# EAGLE schematic 140182-1-v2.1-j2b-synth (EAGLE 6.6.0)
AUTHOR: CPV; NRS: 140182-1; REV: 2.1

## Sheet 1 of 6
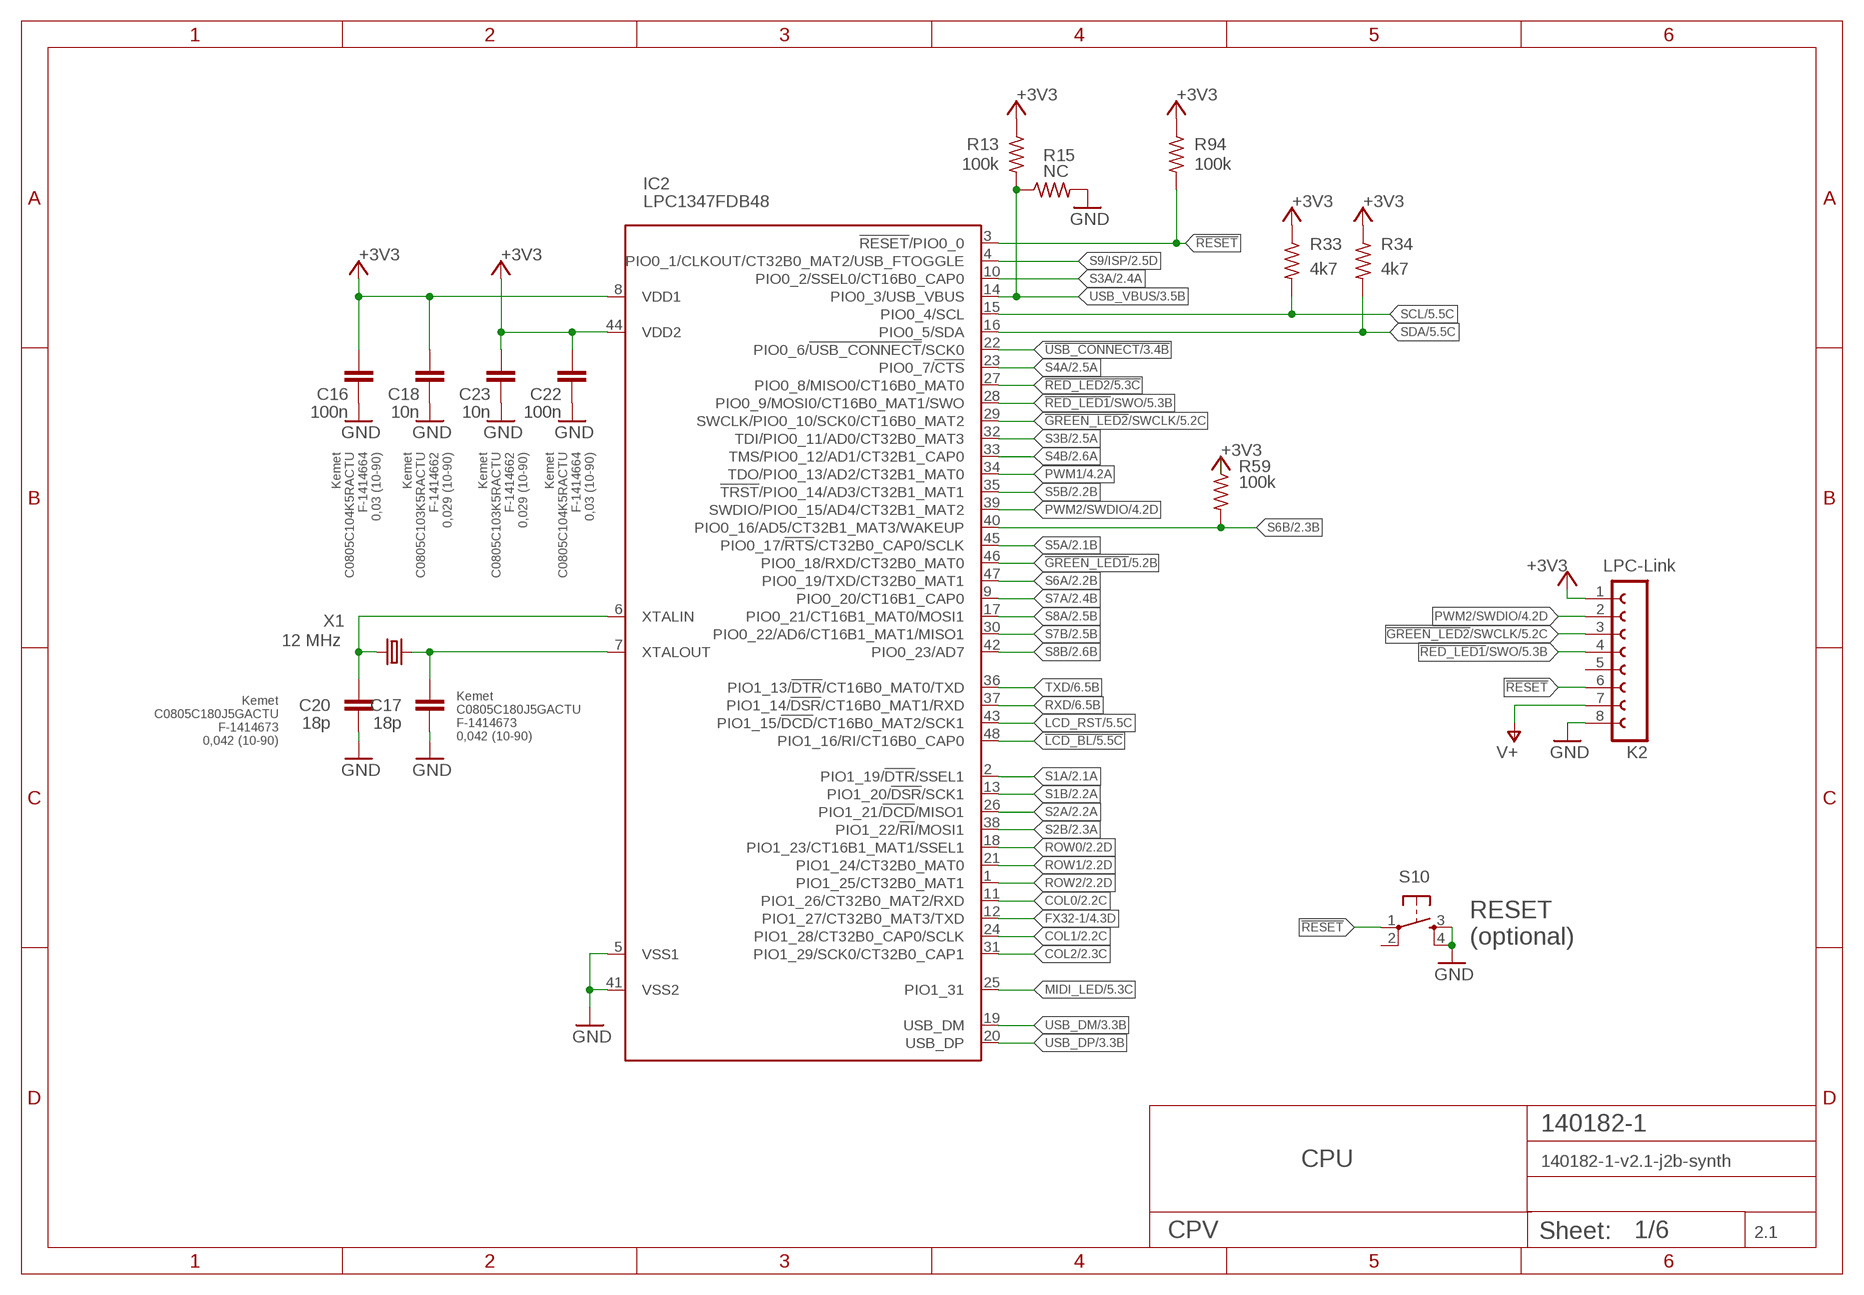
[diagram p0: schematic, sheet 1]

### Parts
C16  100n  C-EUC0805K  [C0805K]
C17  18p  C-EUC0805K  [C0805K]
C18  10n  C-EUC0805K  [C0805K]
C20  18p  C-EUC0805K  [C0805K]
C22  100n  C-EUC0805K  [C0805K]
C23  10n  C-EUC0805K  [C0805K]
IC2  LPC1347FDB48  [LQFP48]
K2  LPC-Link  FE08-1  [FE08]
R13  100k  R-US_R0805  [R0805]
R15  NC  R-US_R0805  [R0805]
R33  4k7  R-US_R0805  [R0805]
R34  4k7  R-US_R0805  [R0805]
R59  100k  R-US_R0805  [R0805]
R94  100k  R-US_R0805  [R0805]
S10  S-TACTILE-6X6-PTH  [EPP-S-TACT-6X6]
X1  12 MHz  CRYSTALSM49  [SM49]

### Nets
!GREEN_LED1!: IC2.46(PIO0_18/RXD/CT32B0_MAT0) ; also sheet 5
!GREEN_LED2!/SWCLK: IC2.29(SWCLK/PIO0_10/SCK0/CT16B0_MAT2) K2.3 ; also sheet 5
!LCD_BL: IC2.48(PIO1_16/RI/CT16B0_CAP0) ; also sheet 5
!RED_LED1!/SWO: IC2.28(PIO0_9/MOSI0/CT16B0_MAT1/SWO) K2.4 ; also sheet 5
!RED_LED2: IC2.27(PIO0_8/MISO0/CT16B0_MAT0) ; also sheet 5
!RESET: IC2.3(!RESET!/PIO0_0) K2.6 R94.2 S10.1
!USB_CONNECT: IC2.22(PIO0_6/!USB_CONNECT!/SCK0) ; also sheet 3
+3V3: C16.2 C18.2 C22.2 C23.2 IC2.8(VDD1) IC2.44(VDD2) K2.1 R13.1 R33.1 R34.1 R59.1 R94.1 ; also sheet 2,3,4,5
+5V: K2.7 ; supply symbol labelled V+ ; also sheet 3,4,5,6
COL0: IC2.11(PIO1_26/CT32B0_MAT2/RXD) ; also sheet 2
COL1: IC2.24(PIO1_28/CT32B0_CAP0/SCLK) ; also sheet 2
COL2: IC2.31(PIO1_29/SCK0/CT32B0_CAP1) ; also sheet 2
FX32-1: IC2.12(PIO1_27/CT32B0_MAT3/TXD) ; also sheet 4
GND: C16.1 C17.1 C18.1 C20.1 C22.1 C23.1 IC2.5(VSS1) IC2.41(VSS2) K2.8 R15.2 S10.3 S10.4 ; also sheet 2,3,4,5,6
LCD_RST: IC2.43(PIO1_15/!DCD!/CT16B0_MAT2/SCK1) ; also sheet 5
MIDI_LED: IC2.25(PIO1_31) ; also sheet 5
N$4: C20.2 IC2.6(XTALIN) X1.1
N$5: C17.2 IC2.7(XTALOUT) X1.2
PWM1: IC2.34(TDO/PIO0_13/AD2/CT32B1_MAT0) ; also sheet 4
PWM2/SWDIO: IC2.39(SWDIO/PIO0_15/AD4/CT32B1_MAT2) K2.2 ; also sheet 4
ROW0: IC2.18(PIO1_23/CT16B1_MAT1/SSEL1) ; also sheet 2
ROW1: IC2.21(PIO1_24/CT32B0_MAT0) ; also sheet 2
ROW2: IC2.1(PIO1_25/CT32B0_MAT1) ; also sheet 2
RXD: IC2.37(PIO1_14/!DSR!/CT16B0_MAT1/RXD) ; also sheet 6
S1A: IC2.2(PIO1_19/!DTR!/SSEL1) ; also sheet 2
S1B: IC2.13(PIO1_20/!DSR!/SCK1) ; also sheet 2
S2A: IC2.26(PIO1_21/!DCD!/MISO1) ; also sheet 2
S2B: IC2.38(PIO1_22/!RI!/MOSI1) ; also sheet 2
S3A: IC2.10(PIO0_2/SSEL0/CT16B0_CAP0) ; also sheet 2
S3B: IC2.32(TDI/PIO0_11/AD0/CT32B0_MAT3) ; also sheet 2
S4A: IC2.23(PIO0_7/!CTS) ; also sheet 2
S4B: IC2.33(TMS/PIO0_12/AD1/CT32B1_CAP0) ; also sheet 2
S5A: IC2.45(PIO0_17/!RTS!/CT32B0_CAP0/SCLK) ; also sheet 2
S5B: IC2.35(!TRST!/PIO0_14/AD3/CT32B1_MAT1) ; also sheet 2
S6A: IC2.47(PIO0_19/TXD/CT32B0_MAT1) ; also sheet 2
S6B: IC2.40(PIO0_16/AD5/CT32B1_MAT3/WAKEUP) R59.2 ; also sheet 2
S7A: IC2.9(PIO0_20/CT16B1_CAP0) ; also sheet 2
S7B: IC2.30(PIO0_22/AD6/CT16B1_MAT1/MISO1) ; also sheet 2
S8A: IC2.17(PIO0_21/CT16B1_MAT0/MOSI1) ; also sheet 2
S8B: IC2.42(PIO0_23/AD7) ; also sheet 2
S9/ISP: IC2.4(PIO0_1/CLKOUT/CT32B0_MAT2/USB_FTOGGLE) ; also sheet 2
SCL: IC2.15(PIO0_4/SCL) R33.2 ; also sheet 5
SDA: IC2.16(PIO0_5/SDA) R34.2 ; also sheet 5
TXD: IC2.36(PIO1_13/!DTR!/CT16B0_MAT0/TXD) ; also sheet 6
USB_DM: IC2.19(USB_DM) ; also sheet 3
USB_DP: IC2.20(USB_DP) ; also sheet 3
USB_VBUS: IC2.14(PIO0_3/USB_VBUS) R13.2 R15.1 ; also sheet 3
Unconnected: K2.5 S10.2

### Notes on the sheet
- RESET
  (optional)
- CPU

## Sheet 2 of 6
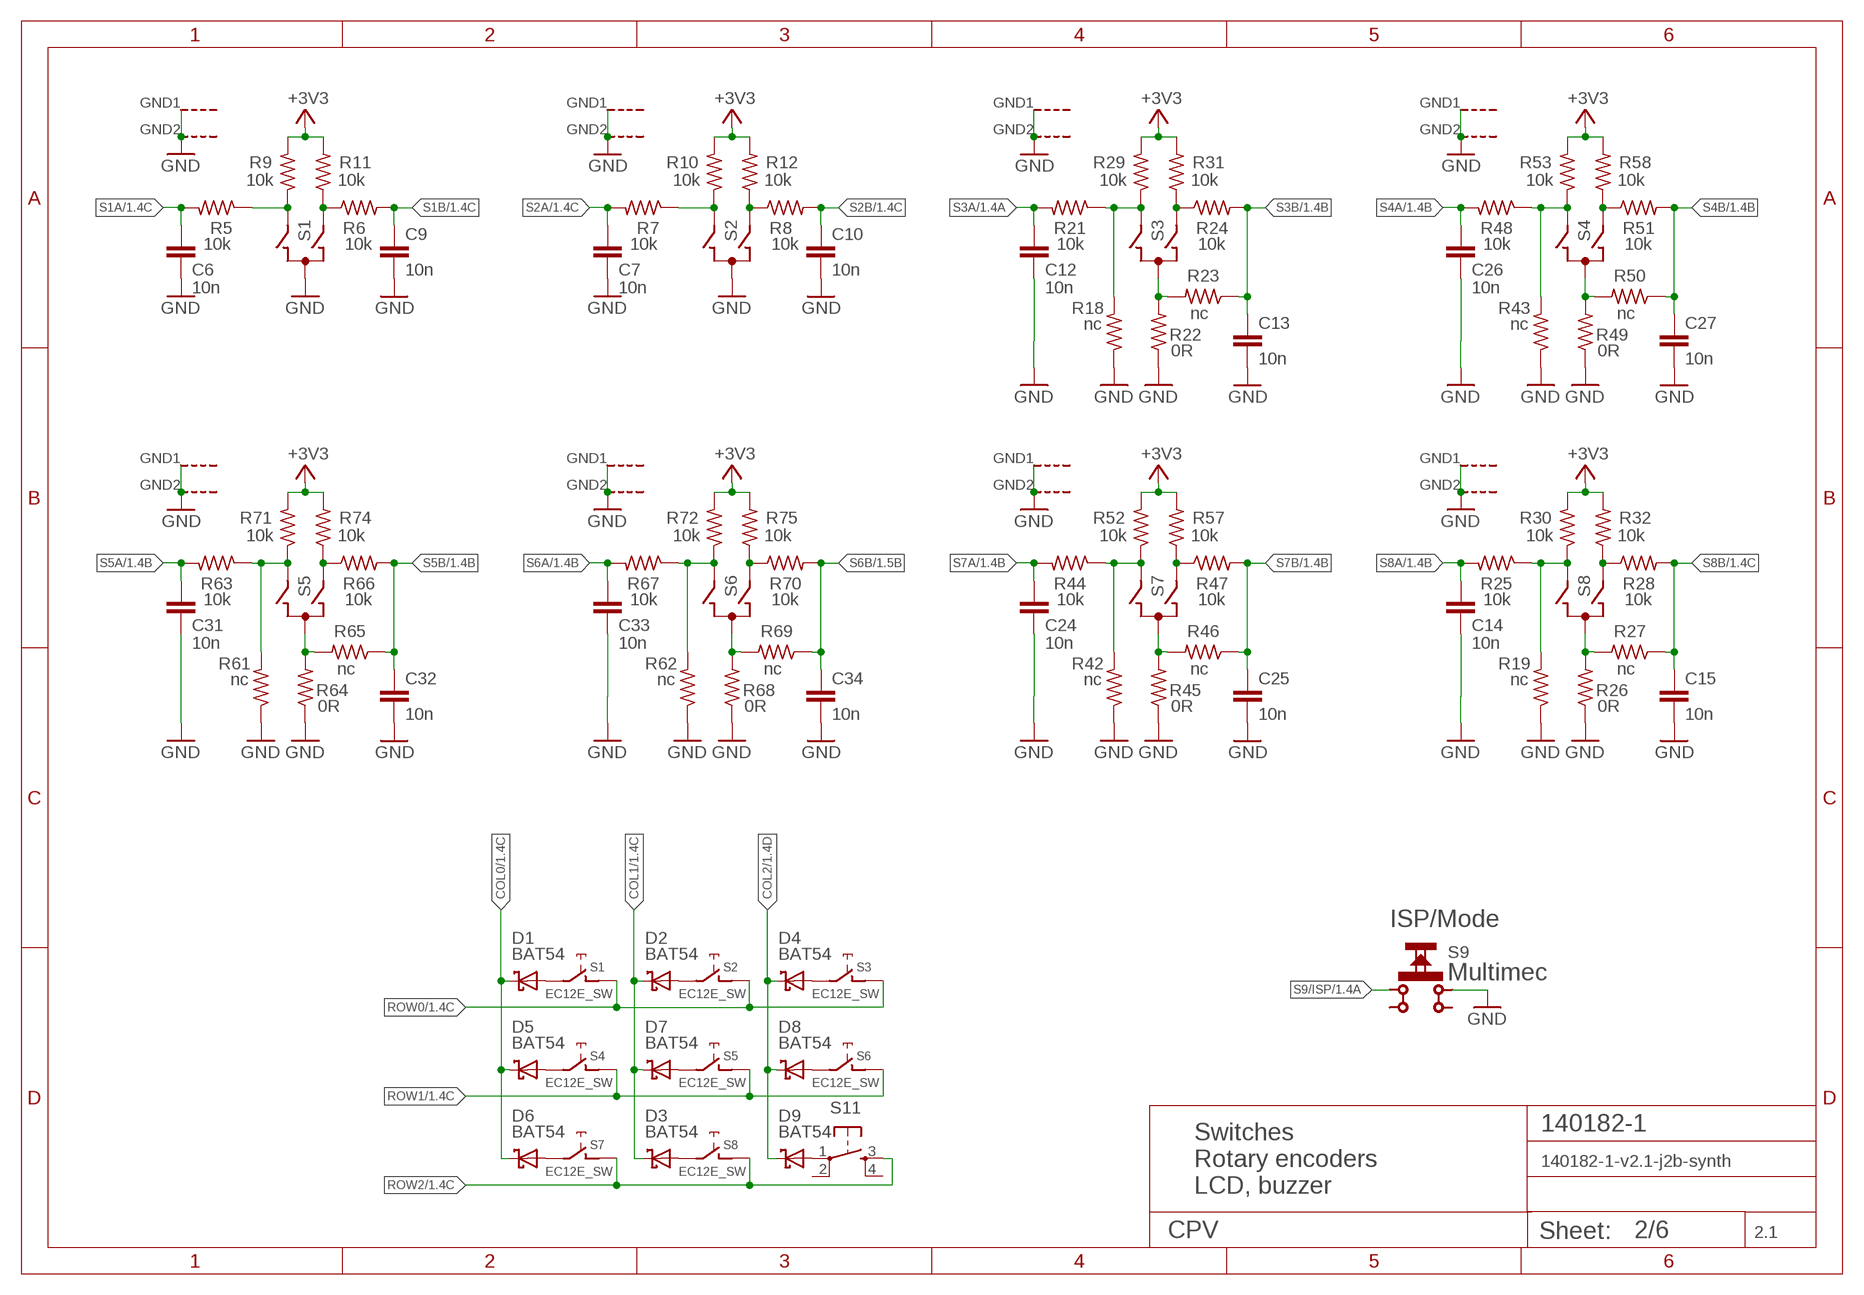
[diagram p1: schematic, sheet 2]

### Parts
C6  10n  C-EUC0805K  [C0805K]
C7  10n  C-EUC0805K  [C0805K]
C9  10n  C-EUC0805K  [C0805K]
C10  10n  C-EUC0805K  [C0805K]
C12  10n  C-EUC0805K  [C0805K]
C13  10n  C-EUC0805K  [C0805K]
C14  10n  C-EUC0805K  [C0805K]
C15  10n  C-EUC0805K  [C0805K]
C24  10n  C-EUC0805K  [C0805K]
C25  10n  C-EUC0805K  [C0805K]
C26  10n  C-EUC0805K  [C0805K]
C27  10n  C-EUC0805K  [C0805K]
C31  10n  C-EUC0805K  [C0805K]
C32  10n  C-EUC0805K  [C0805K]
C33  10n  C-EUC0805K  [C0805K]
C34  10n  C-EUC0805K  [C0805K]
D1  BAT54  [SOT23]
D2  BAT54  [SOT23]
D3  BAT54  [SOT23]
D4  BAT54  [SOT23]
D5  BAT54  [SOT23]
D6  BAT54  [SOT23]
D7  BAT54  [SOT23]
D8  BAT54  [SOT23]
D9  BAT54  [SOT23]
R5  10k  R-US_R0805  [R0805]
R6  10k  R-US_R0805  [R0805]
R7  10k  R-US_R0805  [R0805]
R8  10k  R-US_R0805  [R0805]
R9  10k  R-US_R0805  [R0805]
R10  10k  R-US_R0805  [R0805]
R11  10k  R-US_R0805  [R0805]
R12  10k  R-US_R0805  [R0805]
R18  nc  R-US_R0805  [R0805]
R19  nc  R-US_R0805  [R0805]
R21  10k  R-US_R0805  [R0805]
R22  0R  R-US_R0805  [R0805]
R23  nc  R-US_R0805  [R0805]
R24  10k  R-US_R0805  [R0805]
R25  10k  R-US_R0805  [R0805]
R26  0R  R-US_R0805  [R0805]
R27  nc  R-US_R0805  [R0805]
R28  10k  R-US_R0805  [R0805]
R29  10k  R-US_R0805  [R0805]
R30  10k  R-US_R0805  [R0805]
R31  10k  R-US_R0805  [R0805]
R32  10k  R-US_R0805  [R0805]
R42  nc  R-US_R0805  [R0805]
R43  nc  R-US_R0805  [R0805]
R44  10k  R-US_R0805  [R0805]
R45  0R  R-US_R0805  [R0805]
R46  nc  R-US_R0805  [R0805]
R47  10k  R-US_R0805  [R0805]
R48  10k  R-US_R0805  [R0805]
R49  0R  R-US_R0805  [R0805]
R50  nc  R-US_R0805  [R0805]
R51  10k  R-US_R0805  [R0805]
R52  10k  R-US_R0805  [R0805]
R53  10k  R-US_R0805  [R0805]
R57  10k  R-US_R0805  [R0805]
R58  10k  R-US_R0805  [R0805]
R61  nc  R-US_R0805  [R0805]
R62  nc  R-US_R0805  [R0805]
R63  10k  R-US_R0805  [R0805]
R64  0R  R-US_R0805  [R0805]
R65  nc  R-US_R0805  [R0805]
R66  10k  R-US_R0805  [R0805]
R67  10k  R-US_R0805  [R0805]
R68  0R  R-US_R0805  [R0805]
R69  nc  R-US_R0805  [R0805]
R70  10k  R-US_R0805  [R0805]
R71  10k  R-US_R0805  [R0805]
R72  10k  R-US_R0805  [R0805]
R74  10k  R-US_R0805  [R0805]
R75  10k  R-US_R0805  [R0805]
S1  EC12E_SW  [ALPS_EC12E_SW]
S2  EC12E_SW  [ALPS_EC12E_SW]
S3  EC12E_SW  [ALPS_EC12E_SW]
S4  EC12E_SW  [ALPS_EC12E_SW]
S5  EC12E_SW  [ALPS_EC12E_SW]
S6  EC12E_SW  [ALPS_EC12E_SW]
S7  EC12E_SW  [ALPS_EC12E_SW]
S8  EC12E_SW  [ALPS_EC12E_SW]
S9  Multimec  PUSH_BUTTON_MULTIMEC_4_PIN  [PUSHBUTTON_MULTIMEC]
S11  S-TACTILE-6X6-PTH  [EPP-S-TACT-6X6]

### Nets
+3V3: R9.2 R10.2 R11.2 R12.2 R29.2 R30.2 R31.2 R32.2 R52.2 R53.2 R57.2 R58.2 R71.2 R72.2 R74.2 R75.2 ; also sheet 1,3,4,5
COL0: D1.3(C) D5.3(C) D6.3(C) ; also sheet 1
COL1: D2.3(C) D3.3(C) D7.3(C) ; also sheet 1
COL2: D4.3(C) D8.3(C) D9.3(C) ; also sheet 1
GND: C6.1 C7.1 C9.1 C10.1 C12.1 C13.1 C14.1 C15.1 C24.1 C25.1 C26.1 C27.1 C31.1 C32.1 C33.1 C34.1 R18.1 R19.1 R22.1 R26.1 R42.1 R43.1 R45.1 R49.1 R61.1 R62.1 R64.1 R68.1 S1.C S1.GND1(G) S1.GND2(G) S2.C S2.GND1(G) S2.GND2(G) S3.GND1(G) S3.GND2(G) S4.GND1(G) S4.GND2(G) S5.GND1(G) S5.GND2(G) S6.GND1(G) S6.GND2(G) S7.GND1(G) S7.GND2(G) S8.GND1(G) S8.GND2(G) S9.3 ; also sheet 1,3,4,5,6
N$1: D9.1(A) S11.1
N$35: D1.1(A) S1.E
N$36: D2.1(A) S2.E
N$46: R66.1 R74.1 S5.A
N$47: R61.2 R63.1 R71.1 S5.B
N$70: D4.1(A) S3.E
N$71: D5.1(A) S4.E
N$74: D7.1(A) S5.E
N$75: D8.1(A) S6.E
N$76: D6.1(A) S7.E
N$77: D3.1(A) S8.E
N$78: R64.2 R65.2 S5.C
N$79: R6.1 R11.1 S1.A
N$80: R5.1 R9.1 S1.B
N$82: R70.1 R75.1 S6.A
N$83: R62.2 R67.1 R72.1 S6.B
N$84: R68.2 R69.2 S6.C
N$85: R8.1 R12.1 S2.A
N$86: R7.1 R10.1 S2.B
N$88: R47.1 R57.1 S7.A
N$89: R42.2 R44.1 R52.1 S7.B
N$90: R45.2 R46.2 S7.C
N$91: R24.1 R31.1 S3.A
N$92: R18.2 R21.1 R29.1 S3.B
N$93: R22.2 R23.2 S3.C
N$108: R28.1 R32.1 S8.A
N$109: R19.2 R25.1 R30.1 S8.B
N$110: R26.2 R27.2 S8.C
N$111: R51.1 R58.1 S4.A
N$112: R43.2 R48.1 R53.1 S4.B
N$113: R49.2 R50.2 S4.C
ROW0: S1.D S2.D S3.D ; also sheet 1
ROW1: S4.D S5.D S6.D ; also sheet 1
ROW2: S7.D S8.D S11.3 ; also sheet 1
S1A: C6.2 R5.2 ; also sheet 1
S1B: C9.2 R6.2 ; also sheet 1
S2A: C7.2 R7.2 ; also sheet 1
S2B: C10.2 R8.2 ; also sheet 1
S3A: C12.2 R21.2 ; also sheet 1
S3B: C13.2 R23.1 R24.2 ; also sheet 1
S4A: C26.2 R48.2 ; also sheet 1
S4B: C27.2 R50.1 R51.2 ; also sheet 1
S5A: C31.2 R63.2 ; also sheet 1
S5B: C32.2 R65.1 R66.2 ; also sheet 1
S6A: C33.2 R67.2 ; also sheet 1
S6B: C34.2 R69.1 R70.2 ; also sheet 1
S7A: C24.2 R44.2 ; also sheet 1
S7B: C25.2 R46.1 R47.2 ; also sheet 1
S8A: C14.2 R25.2 ; also sheet 1
S8B: C15.2 R27.1 R28.2 ; also sheet 1
S9/ISP: S9.1 ; also sheet 1
Unconnected: S9.2 S9.4 S11.2 S11.4

### Notes on the sheet
- ISP/Mode
- Switches
- Rotary encoders
- LCD, buzzer

## Sheet 3 of 6
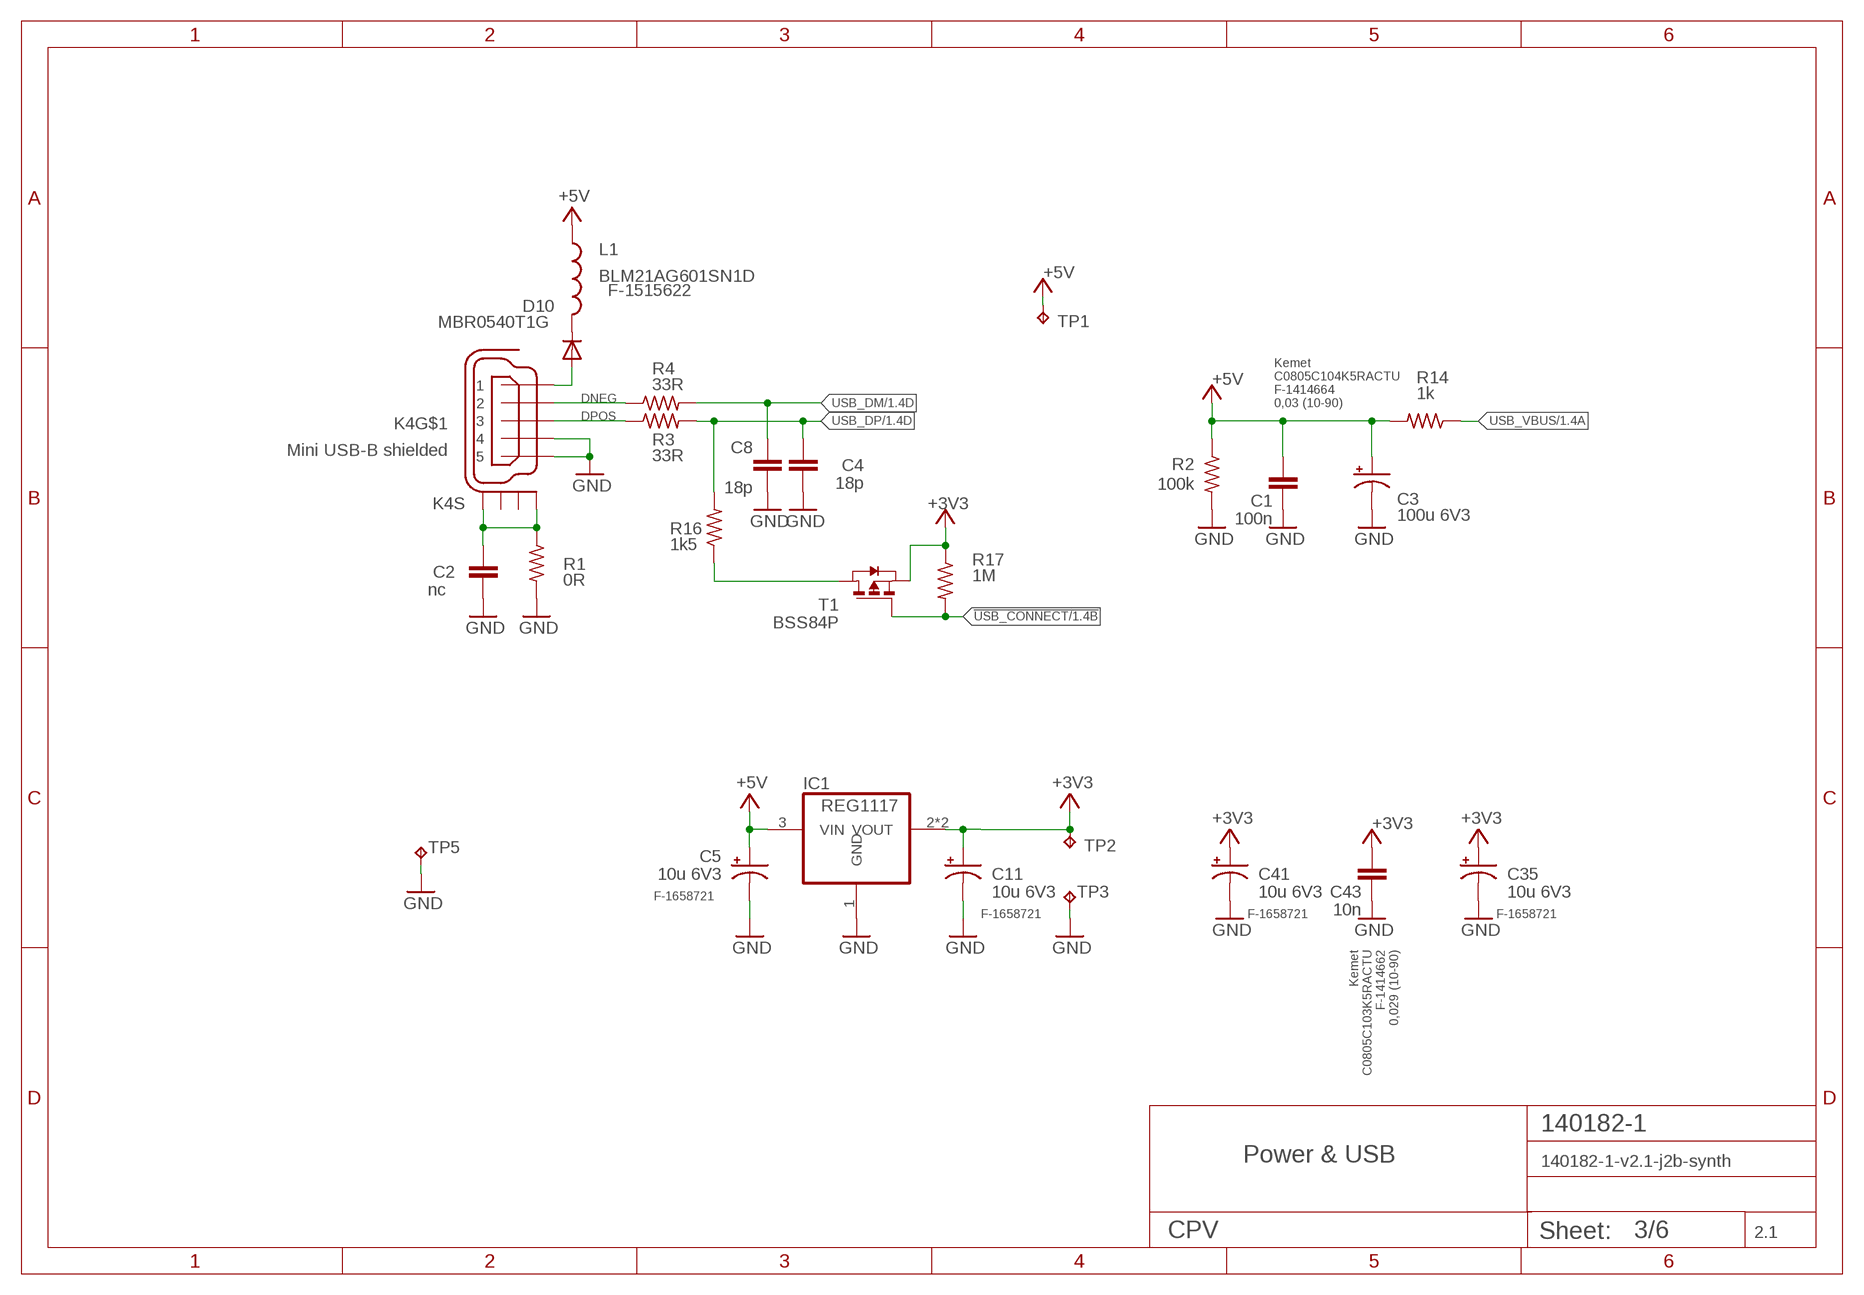
[diagram p2: schematic, sheet 3]

### Parts
C1  100n  C-EUC0805K  [C0805K]
C2  nc  C-EUC0805K  [C0805K]
C3  100u 6V3  CPOL-USB/3528-21R  [B/3528-21R]
C4  18p  C-EUC0805K  [C0805K]
C5  10u 6V3  CPOL-USSMCZ  [SMC_Z]
C8  18p  C-EUC0805K  [C0805K]
C11  10u 6V3  CPOL-USSMCZ  [SMC_Z]
C35  10u 6V3  CPOL-USSMCZ  [SMC_Z]
C41  10u 6V3  CPOL-USSMCZ  [SMC_Z]
C43  10n  C-EUC0805K  [C0805K]
D10  MBR0540T1G  MBR0520LT  [SOD123]
IC1  REG1117  [SOT223]
K4  Mini USB-B shielded  MINI-USB-SCHIELD-32005-301  [USB-MINI-B]
L1  BLM21AG601SN1D  INDUCTOR0805  [0805]
R1  0R  R-US_R0805  [R0805]
R2  100k  R-US_R0805  [R0805]
R3  33R  R-US_R0805  [R0805]
R4  33R  R-US_R0805  [R0805]
R14  1k  R-US_R0805  [R0805]
R16  1k5  R-US_R0805  [R0805]
R17  1M  R-US_R0805  [R0805]
T1  BSS84P  PMOSSOT23  [SOT-23]
TP1  TPPAD1-13  [P1-13]
TP2  TPPAD1-13  [P1-13]
TP3  TPPAD1-13  [P1-13]
TP5  TPPAD1-13  [P1-13]

### Nets
!USB_CONNECT: R17.2 T1.3(G) ; also sheet 1
+3V3: C11.+ C35.+ C41.+ C43.2 IC1.2(VOUT) IC1.4(VOUT) R17.1 T1.2(S) TP2.TP ; also sheet 1,2,4,5
+5V: C1.2 C3.+ C5.+ IC1.3(VIN) L1.2 R2.1 R14.2 TP1.TP ; also sheet 1,4,5,6
DNEG: K4.2 R4.1
DPOS: K4.3 R3.1
GND: C1.1 C2.2 C3.- C4.2 C5.- C8.2 C11.- C35.- C41.- C43.1 IC1.1(GND) K4.4 K4.5 R1.2 R2.2 TP3.TP TP5.TP ; also sheet 1,2,4,5,6
N$6: D10.C L1.1
N$9: C2.1 K4.M1(S:S1) K4.M4(S:S4) R1.1
N$19: D10.A K4.1
N$28: R16.1 T1.1(D)
USB_DM: C8.1 R4.2 ; also sheet 1
USB_DP: C4.1 R3.2 R16.2 ; also sheet 1
USB_VBUS: R14.1 ; also sheet 1
Unconnected: K4.M2(S:S2) K4.M3(S:S3)

### Notes on the sheet
- F-1515622
- Power & USB

## Sheet 4 of 6
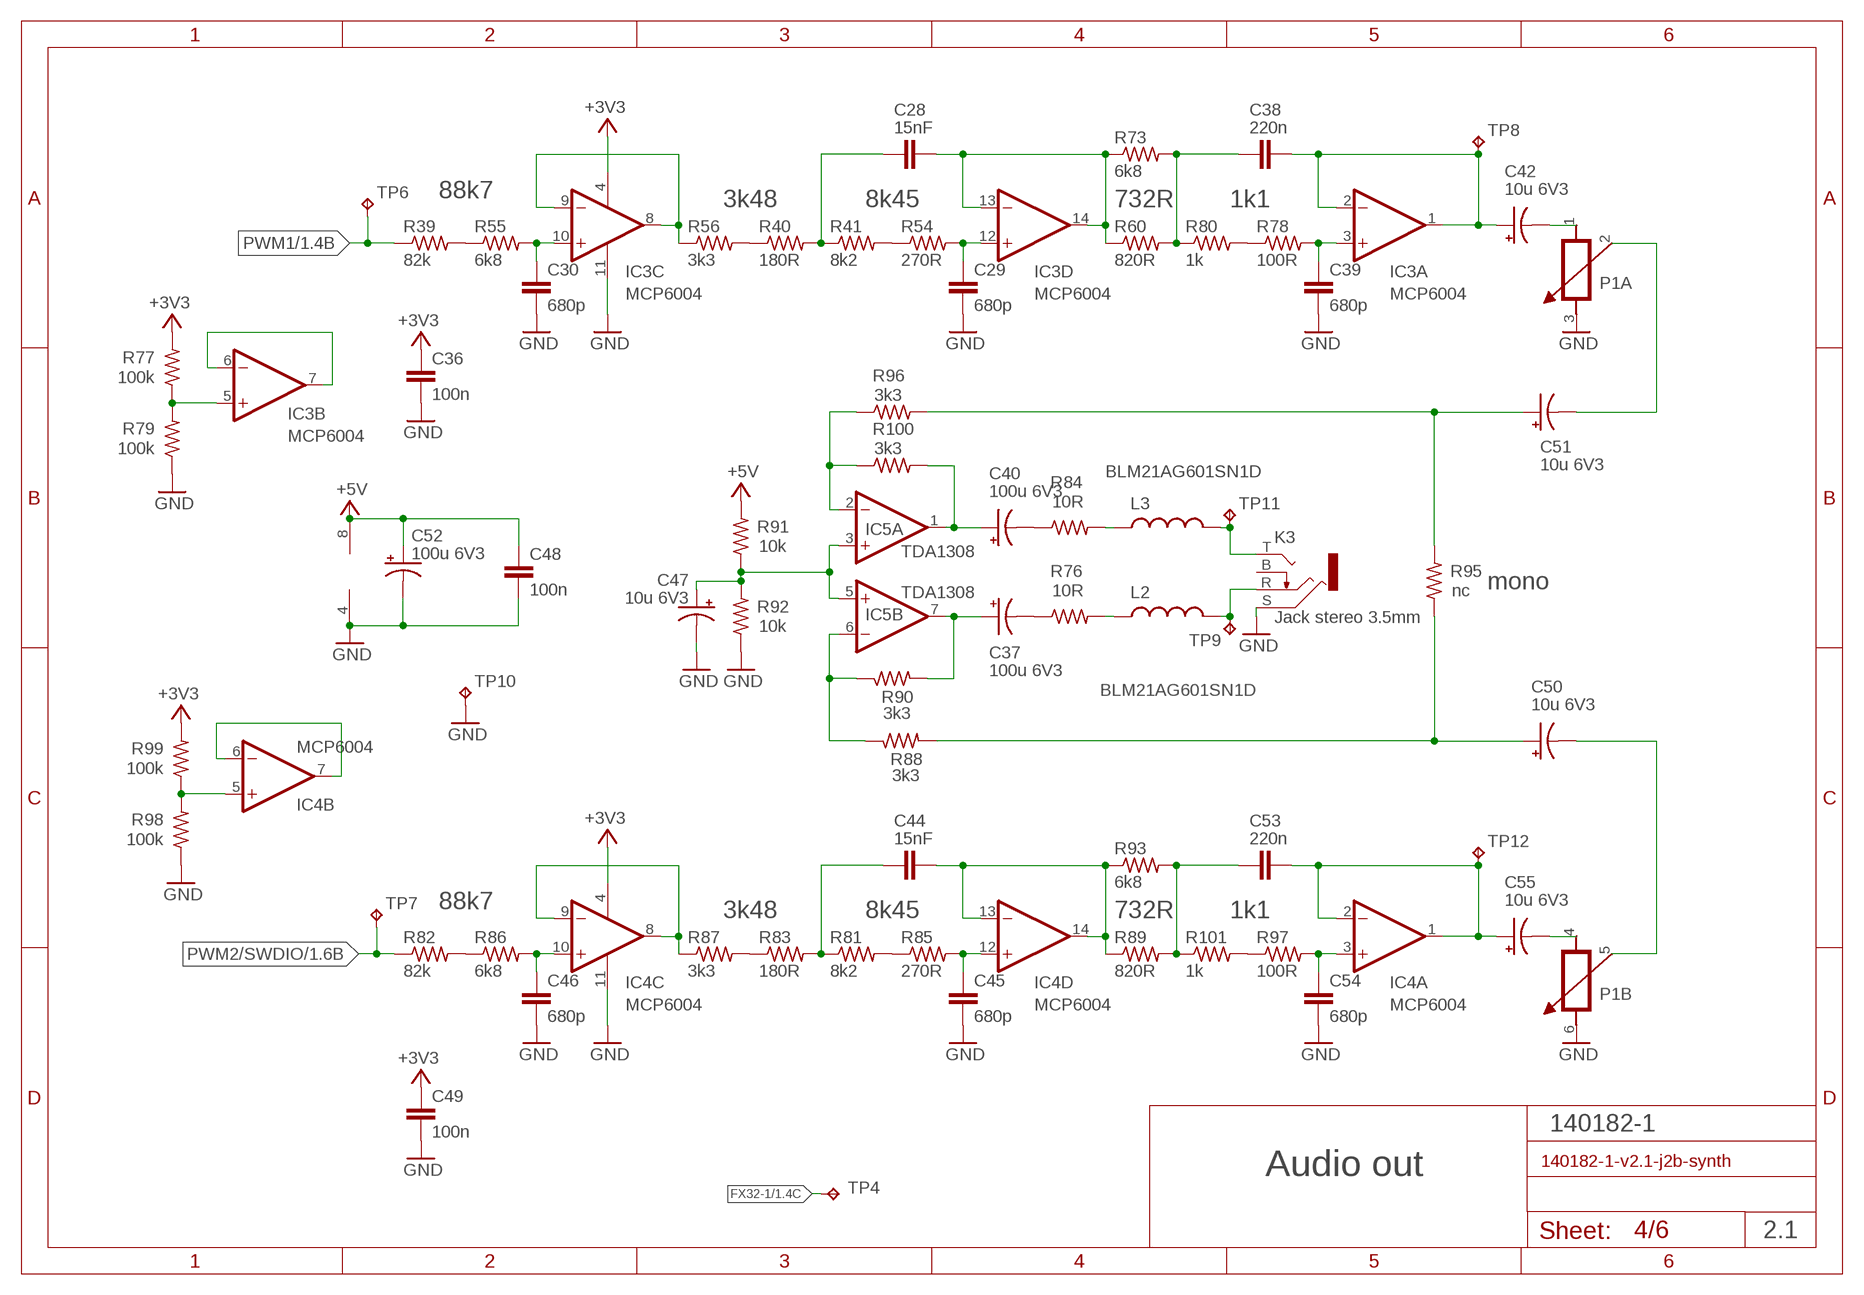
[diagram p3: schematic, sheet 4]

### Parts
C28  15nF  C-EUC0805K  [C0805K]
C29  680p  C-EUC0805K  [C0805K]
C30  680p  C-EUC0805K  [C0805K]
C36  100n  C-EUC0805K  [C0805K]
C37  100u 6V3  CPOL-USB/3528-21R  [B/3528-21R]
C38  220n  C-EUC0805K  [C0805K]
C39  680p  C-EUC0805K  [C0805K]
C40  100u 6V3  CPOL-USB/3528-21R  [B/3528-21R]
C42  10u 6V3  CPOL-USSMCZ  [SMC_Z]
C44  15nF  C-EUC0805K  [C0805K]
C45  680p  C-EUC0805K  [C0805K]
C46  680p  C-EUC0805K  [C0805K]
C47  10u 6V3  CPOL-USSMCZ  [SMC_Z]
C48  100n  C-EUC0805K  [C0805K]
C49  100n  C-EUC0805K  [C0805K]
C50  10u 6V3  CPOL-USSMCZ  [SMC_Z]
C51  10u 6V3  CPOL-USSMCZ  [SMC_Z]
C52  100u 6V3  CPOL-USB/3528-21R  [B/3528-21R]
C53  220n  C-EUC0805K  [C0805K]
C54  680p  C-EUC0805K  [C0805K]
C55  10u 6V3  CPOL-USSMCZ  [SMC_Z]
IC3  MCP6004  TL074D  [SO14]
IC4  MCP6004  TL074D  [SO14]
IC5  TDA1308  LM1458D  [SO08]
K3  Jack stereo 3.5mm  K-JACK-STEREO-3.5MM  [EPP-JACK-35]
L2  BLM21AG601SN1D  INDUCTOR0805  [0805]
L3  BLM21AG601SN1D  INDUCTOR0805  [0805]
P1  POT-BOURNS-PDT90  [POT-BOURNS-PTD90-2-WAY]
R39  82k  R-US_R0805  [R0805]
R40  180R  R-US_R0805  [R0805]
R41  8k2  R-US_R0805  [R0805]
R54  270R  R-US_R0805  [R0805]
R55  6k8  R-US_R0805  [R0805]
R56  3k3  R-US_R0805  [R0805]
R60  820R  R-US_R0805  [R0805]
R73  6k8  R-US_R0805  [R0805]
R76  10R  R-US_R0805  [R0805]
R77  100k  R-US_R0805  [R0805]
R78  100R  R-US_R0805  [R0805]
R79  100k  R-US_R0805  [R0805]
R80  1k  R-US_R0805  [R0805]
R81  8k2  R-US_R0805  [R0805]
R82  82k  R-US_R0805  [R0805]
R83  180R  R-US_R0805  [R0805]
R84  10R  R-US_R0805  [R0805]
R85  270R  R-US_R0805  [R0805]
R86  6k8  R-US_R0805  [R0805]
R87  3k3  R-US_R0805  [R0805]
R88  3k3  R-US_R0805  [R0805]
R89  820R  R-US_R0805  [R0805]
R90  3k3  R-US_R0805  [R0805]
R91  10k  R-US_R0805  [R0805]
R92  10k  R-US_R0805  [R0805]
R93  6k8  R-US_R0805  [R0805]
R95  nc  R-US_R0805  [R0805]
R96  3k3  R-US_R0805  [R0805]
R97  100R  R-US_R0805  [R0805]
R98  100k  R-US_R0805  [R0805]
R99  100k  R-US_R0805  [R0805]
R100  3k3  R-US_R0805  [R0805]
R101  1k  R-US_R0805  [R0805]
TP4  TPPAD1-13  [P1-13]
TP6  TPPAD1-13  [P1-13]
TP7  TPPAD1-13  [P1-13]
TP8  TPPAD1-13  [P1-13]
TP9  TPPAD1-13  [P1-13]
TP10  TPPAD1-13  [P1-13]
TP11  TPPAD1-13  [P1-13]
TP12  TPPAD1-13  [P1-13]

### Nets
+3V3: C36.1 C49.1 IC3.4(P:V+) IC4.4(P:V+) R77.2 R99.2 ; also sheet 1,2,3,5
+5V: C48.1 C52.+ IC5.8(P:V+) R91.2 ; also sheet 1,3,5,6
CH1: C38.2 C42.+ IC3.1(A:OUT) IC3.2(A:-IN) TP8.TP
CH2: C53.2 C55.+ IC4.1(A:OUT) IC4.2(A:-IN) TP12.TP
FX32-1: TP4.TP ; also sheet 1
GND: C29.2 C30.2 C36.2 C39.2 C45.2 C46.2 C47.- C48.2 C49.2 C52.- C54.2 IC3.11(P:V-) IC4.11(P:V-) IC5.4(P:V-) K3.S P1.3(A:B) P1.6(B:B) R79.1 R92.1 R98.1 TP10.TP ; also sheet 1,2,3,5,6
HPIN1: C51.+ R95.2 R96.2
HPIN2: C50.+ R88.2 R95.1
N$7: IC5.2(A:-IN) R96.1 R100.1
N$10: C40.+ IC5.1(A:OUT) R100.2
N$12: L3.2 R84.2
N$18: L2.2 R76.2
N$20: C40.- R84.1
N$21: C37.- R76.1
N$25: C46.1 IC4.10(C:+IN) R86.2
N$26: IC5.6(B:-IN) R88.1 R90.1
N$27: C37.+ IC5.7(B:OUT) R90.2
N$29: IC4.8(C:OUT) IC4.9(C:-IN) R87.1
N$33: C45.1 IC4.12(D:+IN) R85.2
N$34: C44.2 IC4.13(D:-IN) IC4.14(D:OUT) R89.1 R93.1
N$40: C54.1 IC4.3(A:+IN) R97.2
N$55: R82.2 R86.1
N$56: R83.1 R87.2
N$57: R81.2 R85.1
N$58: R97.1 R101.2
N$59: C44.1 R81.1 R83.2
N$60: C53.1 R89.2 R93.2 R101.1
N$61: C55.- P1.4(B:A)
N$62: C42.- P1.1(A:A)
N$65: C47.+ IC5.3(A:+IN) IC5.5(B:+IN) R91.1 R92.2
N$67: IC4.5(B:+IN) R98.2 R99.1
N$69: IC4.6(B:-IN) IC4.7(B:OUT)
N$94: C30.1 IC3.10(C:+IN) R55.2
N$95: IC3.8(C:OUT) IC3.9(C:-IN) R56.1
N$96: C29.1 IC3.12(D:+IN) R54.2
N$97: C28.2 IC3.13(D:-IN) IC3.14(D:OUT) R60.1 R73.1
N$98: C39.1 IC3.3(A:+IN) R78.2
N$100: R39.2 R55.1
N$101: R40.1 R56.2
N$102: R41.2 R54.1
N$103: R78.1 R80.2
N$104: C28.1 R40.2 R41.1
N$105: C38.1 R60.2 R73.2 R80.1
N$106: IC3.5(B:+IN) R77.1 R79.2
N$107: IC3.6(B:-IN) IC3.7(B:OUT)
OUT1: K3.T L3.1 TP11.TP
OUT2: K3.R L2.1 TP9.TP
P1AW: C51.- P1.2(A:WIPER)
P1BW: C50.- P1.5(B:WIPER)
PWM1: R39.1 TP6.TP ; also sheet 1
PWM2/SWDIO: R82.1 TP7.TP ; also sheet 1
Unconnected: K3.B

### Notes on the sheet
- 88k7
- 3k48 | 8k45 | 732R | 1k1
- mono
- 88k7
- 3k48 | 8k45 | 732R | 1k1
- Audio out

## Sheet 5 of 6
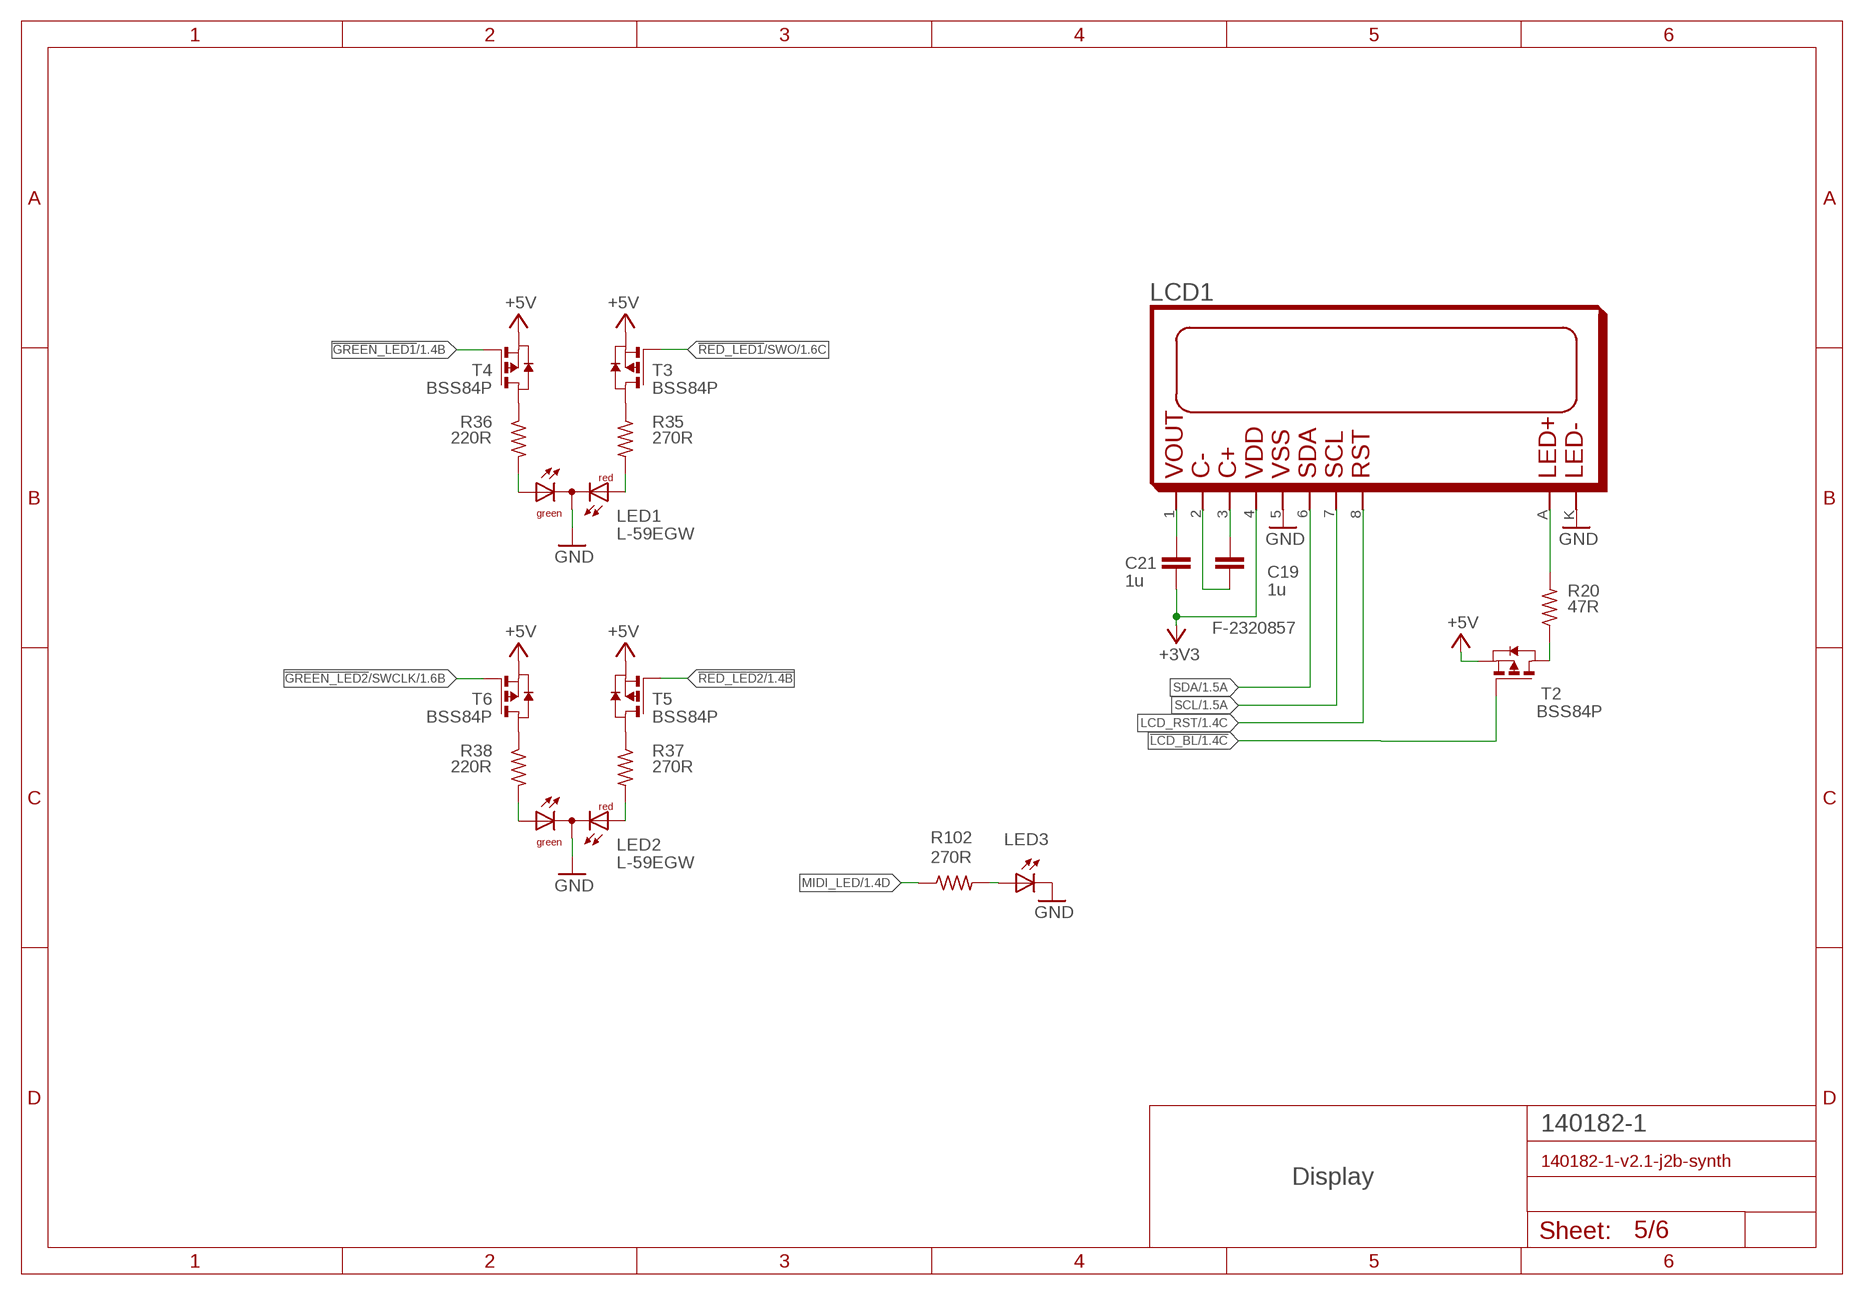
[diagram p4: schematic, sheet 5]

### Parts
C19  1u  C-EUC0805K  [C0805K]
C21  1u  C-EUC0805K  [C0805K]
LCD1  LCD-I2C-MIDAS  [LCD-MIDAS-I2C]
LED1  L-59EGW  DUOLED-RG-C  [DUOLED-C-5MM]
LED2  L-59EGW  DUOLED-RG-C  [DUOLED-C-5MM]
LED3  LED3MM  [LED3MM]
R20  47R  R-US_R1206  [R1206]
R35  270R  R-US_R0805  [R0805]
R36  220R  R-US_R0805  [R0805]
R37  270R  R-US_R0805  [R0805]
R38  220R  R-US_R0805  [R0805]
R102  270R  R-US_R0805  [R0805]
T2  BSS84P  PMOSSOT23  [SOT-23]
T3  BSS84P  PMOSSOT23  [SOT-23]
T4  BSS84P  PMOSSOT23  [SOT-23]
T5  BSS84P  PMOSSOT23  [SOT-23]
T6  BSS84P  PMOSSOT23  [SOT-23]

### Nets
!GREEN_LED1!: T4.3(G) ; also sheet 1
!GREEN_LED2!/SWCLK: T6.3(G) ; also sheet 1
!LCD_BL: T2.3(G) ; also sheet 1
!RED_LED1!/SWO: T3.3(G) ; also sheet 1
!RED_LED2: T5.3(G) ; also sheet 1
+3V3: C21.2 LCD1.4 ; also sheet 1,2,3,4
+5V: T2.2(S) T3.2(S) T4.2(S) T5.2(S) T6.2(S) ; also sheet 1,3,4,6
GND: LCD1.5 LCD1.K LED1.C LED2.C LED3.K(C) ; also sheet 1,2,3,4,6
LCD_RST: LCD1.8 ; also sheet 1
MIDI_LED: R102.1 ; also sheet 1
N$2: LED1.AX(AG) R36.2
N$3: R36.1 T4.1(D)
N$8: C21.1 LCD1.1
N$11: LED1.AR R35.2
N$13: C19.1 LCD1.3
N$14: C19.2 LCD1.2
N$15: R35.1 T3.1(D)
N$16: LED2.AX(AG) R38.2
N$17: R38.1 T6.1(D)
N$22: LED3.A R102.2
N$23: LED2.AR R37.2
N$24: R37.1 T5.1(D)
N$30: R20.1 T2.1(D)
N$31: LCD1.A R20.2
SCL: LCD1.7 ; also sheet 1
SDA: LCD1.6 ; also sheet 1

### Notes on the sheet
- Display

## Sheet 6 of 6
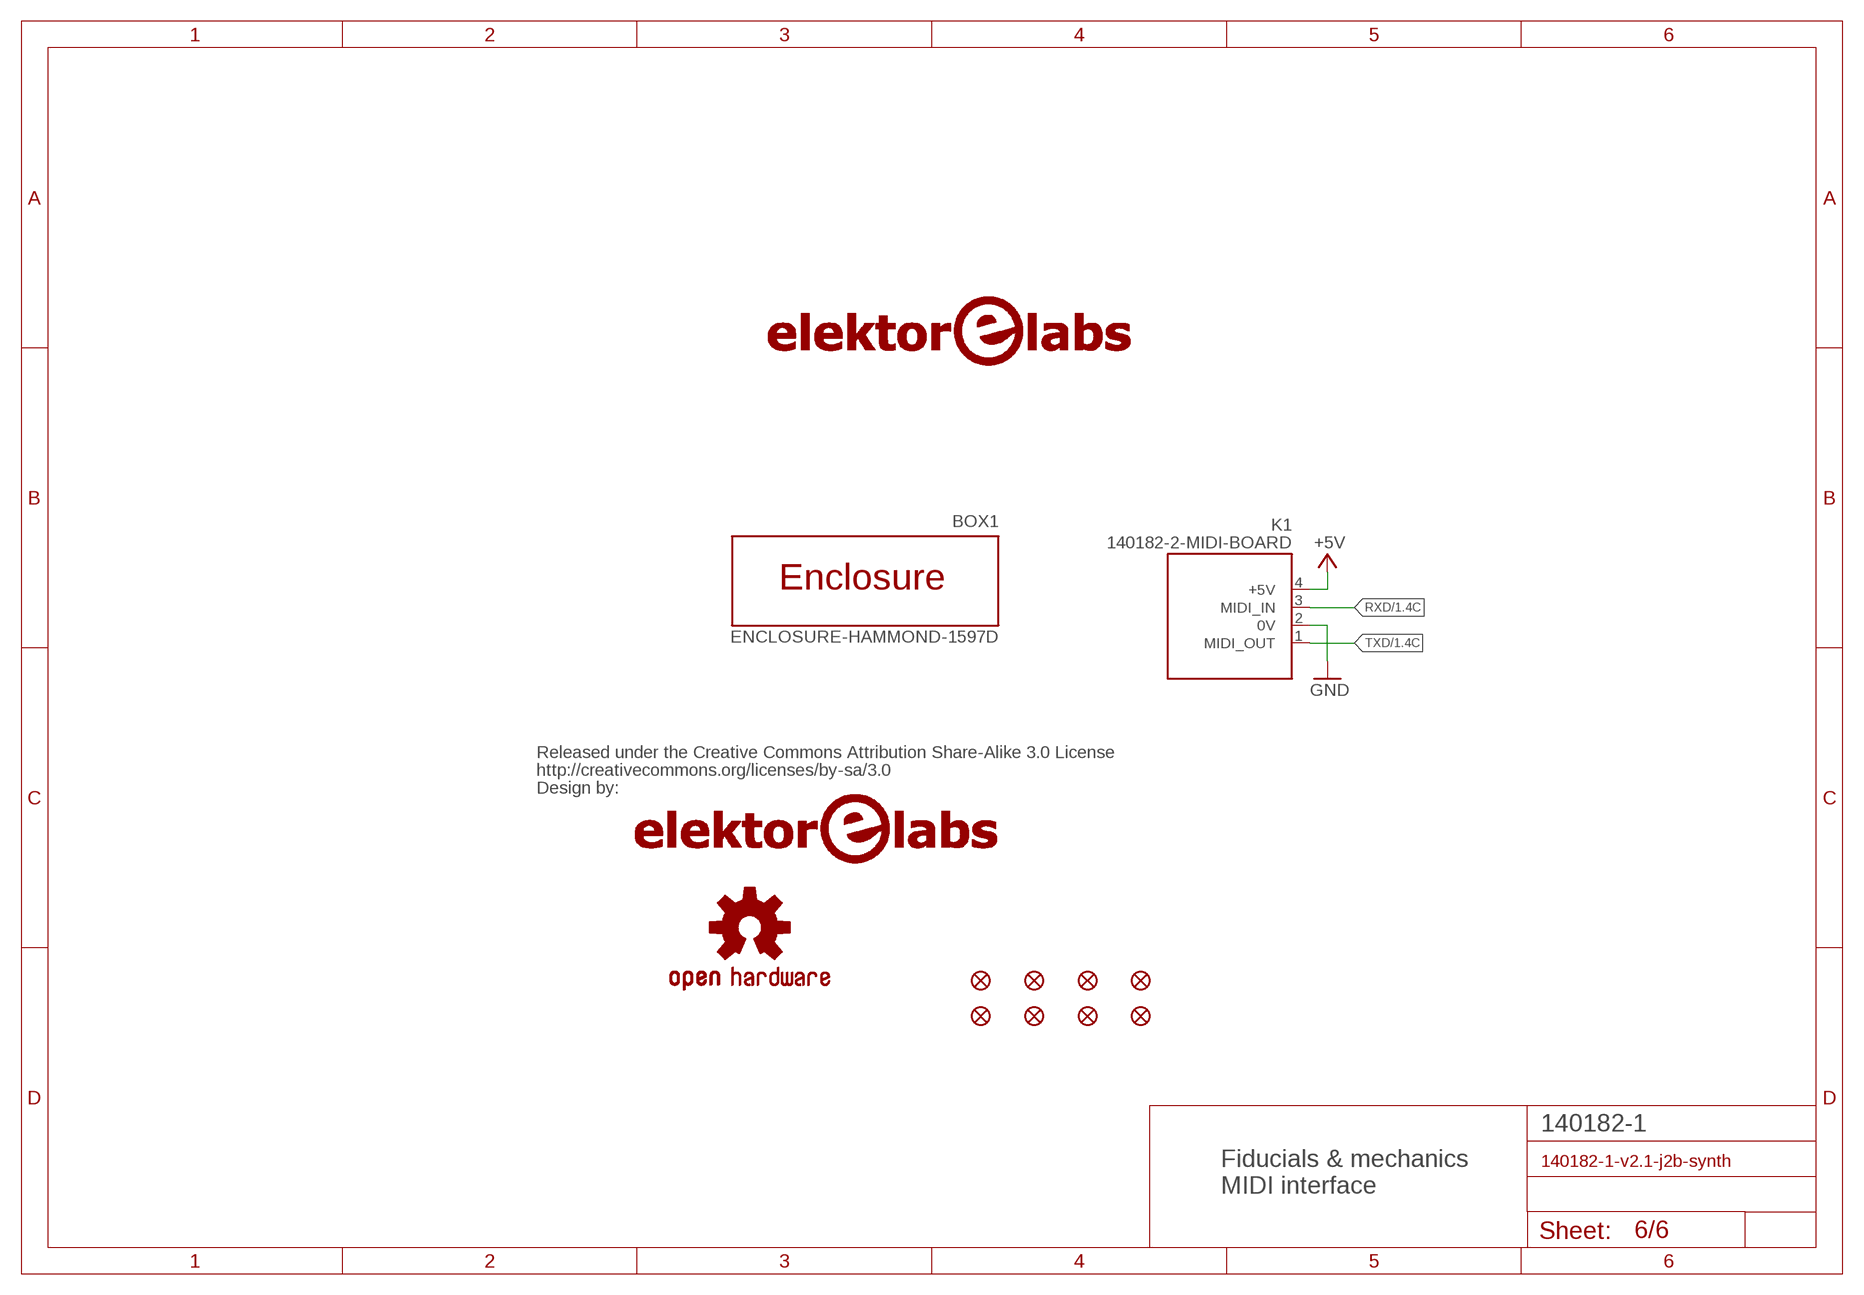
[diagram p5: schematic, sheet 6]

### Parts
BOX1  ENCLOSURE-HAMMOND-1597D  [HAMMOND-1597DGY]
FID1  FIDUCIAL1.5X3  [FIDUCIAL-1.5X3]
FID2  FIDUCIAL1.5X3  [FIDUCIAL-1.5X3]
FID3  FIDUCIAL1.5X3  [FIDUCIAL-1.5X3]
FID4  FIDUCIAL1.5X3  [FIDUCIAL-1.5X3]
FID5  FIDUCIAL1.5X3  [FIDUCIAL-1.5X3]
FID6  FIDUCIAL1.5X3  [FIDUCIAL-1.5X3]
FID7  FIDUCIAL1.5X3  [FIDUCIAL-1.5X3]
FID8  FIDUCIAL1.5X3  [FIDUCIAL-1.5X3]
K1  140182-2-MIDI-BOARD  [140182-2-MIDI_BOARD]
LOGO1  LOGO-ELEKTOR-LABS-42MM  [EPP-LOGO-ELEKTOR-LABS-42MM]
LOGO2  LOGO-ELEKTOR-LABS-42MM  [EPP-LOGO-ELEKTOR-LABS-42MM]
U$1  OSHW-LOGOL  [OSHW-LOGO-L]
U$2  CREATIVE_COMMONS  [CREATIVE_COMMONS]

### Nets
+5V: K1.4(+5V) ; also sheet 1,3,4,5
GND: K1.2(0V) ; also sheet 1,2,3,4,5
RXD: K1.3(MIDI_IN) ; also sheet 1
TXD: K1.1(MIDI_OUT) ; also sheet 1

### Notes on the sheet
- Fiducials & mechanics
- MIDI interface

## Library data of the parts
BOX1 = 140182-1-v1.0-j2b-synth:ENCLOSURE-*: Enclosures
C1 C16 C22 = resistor:C-EU: CAPACITOR, European symbol; FARNELL: F-1414664; MFR: Kemet; MFRREF: C0805C104K5RACTU; PRICE: 0,03 (10-90)
C2 C21 = 110274_J2B_v21:C-EU: CAPACITOR, European symbol
C3 = rcl:CPOL-US: POLARIZED CAPACITOR, American symbol; FARNELL: F-1754068; MFR: Vishay Sprague; MFRREF: TR3D107K010C0065; PRICE: 0,86 (5-45)
C4 C6-C10 C12-C15 C24-C34 C36 C38 C39 C44-C46 C48 C49 C53 C54 = resistor:C-EU: CAPACITOR, European symbol
C5 C11 C35 C41 C42 C47 C50 C51 C55 = 140182-1-v2.1-j2b-synth:CPOL-US: POLARIZED CAPACITOR, American symbol; FARNELL: F-1658721
C17 C20 = resistor:C-EU: CAPACITOR, European symbol; FARNELL: F-1414673; MFR: Kemet; MFRREF: C0805C180J5GACTU; PRICE: 0,042 (10-90)
C18 C23 C43 = resistor:C-EU: CAPACITOR, European symbol; FARNELL: F-1414662; MFR: Kemet; MFRREF: C0805C103K5RACTU; PRICE: 0,029 (10-90)
C19 = 110274_J2B_v21:C-EU: CAPACITOR, European symbol; FARNELL: F-2320857
C37 C40 C52 = rcl:CPOL-US: POLARIZED CAPACITOR, American symbol
D1-D9 = diode:BAT54: Schottky Diodes Source: Fairchild .. BAT54.pdf
D10 = diode:MBR0520LT: SCHOTTKY BARRIER RECTIFIER Source: http://onsemi.com .. MBR0520LT1-D.pdf
FID1-FID8 = SparkFun:FIDUCIAL: Fiducial Alignment Points Various fiducial points for machine vision alignment.
IC1 = cococo-pentagon:REG1117: 800mA and 1A Low Dropout (LDO) Positive Regulator 1.8V, 2.5V, 2.85V, 3.3V, 5V, and Adj; MPN: REG1117; OC_FARNELL: 1097566; OC_NEWARK: 14P6981
IC2 = 110274_J2B_v21:LPC1347FDB48
IC3 IC4 = 140182-1-v2.1-j2b-synth:TL074: OP AMP
IC5 = 140182-1-v2.1-j2b-synth:*1458: OP AMP
K1 = 140182-2-v1.0-j2b-synth-midi:140182-2-MIDI-BOARD
K2 = con-lsta:FE08-1: FEMALE HEADER
K3 = epp-v0.0:K-JACK-STEREO-: Jack connector, JIS C 6560, 3.5 mm; FARNELL: 1217016; RS: 5051479
K4 = 140182-1-v2.1-j2b-synth:MINI-USB-SCHIELD-: MINI USB-B Conector Source: www.cypressindustries.com; FARNELL: F-1125348; MFR: Molex; MFRREF: 675031020; PRICE: 0,93 (1-24)
L1-L3 = 110274_J2B_v21:INDUCTOR: Inductors Basic Inductor/Choke - 0603 and 1206. Footprints are not proven and vary greatly between part numbers.
LCD1 = _Elektor2:LCD-I2C-: LCD with I2C interface
LED1 LED2 = led:DUOLED-RG-C: DUO LED 2 colors (red/green), 5 mm, round, common Cathode www.ligitek.com or other producers.; FARNELL: 2001770
LED3 = led:LED: LED OSRAM: - CHIPLED LG R971, LG N971, LY N971, LG Q971, LY Q971, LO R971, LY R971 LH N974, LH R974 LS Q976, LO Q976, LY Q976 LO Q996 - Hyper CHIPLED LW Q18S LB Q993, LB Q99A, LB R99A - SideLED LS A670, LO A670, LY A670, LG A670, LP A670 LB A673, LV A673, LT A673, LW A673 LH A674 LY A675 LS A676, LA A676, LO A676, LY A676, LW A676 LS A679, LY A679, LG A679 - Hyper Micro SIDELED® LS Y876, LA Y876, LO Y876, LY Y876 LT Y87S - SmartLED LW L88C, LW L88S LB L89C, LB L89S, LG L890 LS L89K, LO L89K, LY L89K LS L896, LA L896, LO L896, LY L896 - TOPLED LS T670, LO T670, LY T670, LG T670, LP T670 LSG T670, LSP T670, LSY T670, LOP T670, LYG T670 LG T671, LOG T671, LSG T671 LB T673, LV T673, LT T673, LW T673 LH T674 LS T676, LA T676, LO T676, LY T676, LB T676, LH T676, LSB T676, LW T676 LB T67C, LV T67C, LT T67C, LS T67K, LO T67K, LY T67K, LW E67C LS E67B, LA E67B, LO E67B, LY E67B, LB E67C, LV E67C, LT E67C LW T67C LS T679, LY T679, LG T679 LS T770, LO T770, LY T770, LG T770, LP T770 LB T773, LV T773, LT T773, LW T773 LH T774 LS E675, LA E675, LY E675, LS T675 LS T776, LA T776, LO T776, LY T776, LB T776 LHGB T686 LT T68C, LB T68C - Hyper Mini TOPLED® LB M676 - Mini TOPLED Santana® LG M470 LS M47K, LO M47K, LY M47K Source: http://www.osram.convergy.de LUXEON: - LUMILED® LXK2-PW12-R00, LXK2-PW12-S00, LXK2-PW14-U00, LXK2-PW14-V00 LXK2-PM12-R00, LXK2-PM12-S00, LXK2-PM14-U00 LXK2-PE12-Q00, LXK2-PE12-R00, LXK2-PE12-S00, LXK2-PE14-T00, LXK2-PE14-U00 LXK2-PB12-K00, LXK2-PB12-L00, LXK2-PB12-M00, LXK2-PB14-N00, LXK2-PB14-P00, LXK2-PB14-Q00 LXK2-PR12-L00, LXK2-PR12-M00, LXK2-PR14-Q00, LXK2-PR14-R00 LXK2-PD12-Q00, LXK2-PD12-R00, LXK2-PD12-S00 LXK2-PH12-R00, LXK2-PH12-S00 LXK2-PL12-P00, LXK2-PL12-Q00, LXK2-PL12-R00 Source: www.luxeon.com KINGBRIGHT: KA-3528ASYC Source: www.kingbright.com
LOGO1 LOGO2 = epp-v0.0:LOGO-ELEKTOR-LABS: Logo, Elektor.Labs
P1 = _Elektor2:POT-BOURNS-PDT90
R1 = resistor:R-US_: RESISTOR, American symbol; FARNELL: F-1576156; MFR: Multicomp; MFRREF: MCHV05WAJ0105T5E; PRICE: 0,051 (10-40)
R2 R13 R59 R94 = resistor:R-US_: RESISTOR, American symbol; FARNELL: F-9333738; MFR: Multicomp; MFRREF: MC 0.1W 0805 5% 100K; PRICE: 0,04 (50-200)
R3 R4 R16 R17 R39-R41 R54-R56 R60 R73 R77-R83 R85-R87 R89 R93 R97-R99 R101 = resistor:R-US_: RESISTOR, American symbol
R5-R8 R14 R18 R19 R21-R28 R42-R51 R61-R70 R76 R84 R88 R90-R92 R95 R96 R100 = resistor:R-US_: RESISTOR, American symbol; FARNELL: F-9333711; MFR: Multicomp; MFRREF: MC 0.1W 0805 5% 1K; PRICE: 0,02 (50-200)
R9-R12 R29-R32 R52 R53 R57 R58 R71 R72 R74 R75 = resistor:R-US_: RESISTOR, American symbol; FARNELL: F-; MFR: Multicomp; MFRREF: MC 0.1W 0805 5% 10K; PRICE: 0,02 (50-200)
R15 = rcl:R-US_: RESISTOR, American symbol
R20 = rcl:R-US_: RESISTOR, American symbol; FARNELL: F-1576615; MFR: Multicomp; MFRREF: MCHP06W2F1000T5E; PRICE: 0,04 (50)
R33 R34 = resistor:R-US_: RESISTOR, American symbol; FARNELL: F-9334580; MFR: Multicomp; MFRREF: MC 0.1W 0805 5% 4K7; PRICE: 0,042 (50-200)
R35-R38 R102 = 140182-1-v2.1-j2b-synth:R-US_: RESISTOR, American symbol; FARNELL: F-1576615; MFR: Multicomp; MFRREF: MCHP06W2F1000T5E; PRICE: 0,04 (50)
S1-S8 = 000_cpv:EC12E_SW: ALPS rotary Encoder EC12E series with switch; MPN: EC12E2424407; OC_FARNELL: 1520813; OC_NEWARK: 74M1068
S9 = _Elektor2:PUSH_BUTTON_MULTIMEC_4_PIN
S10 S11 = elpp-v0.0:S-TACTILE-6X6-: Tactile switch, pushbutton, 6x6 mm.; FARNELL: 1555985; RS: 4791435
T1 = zetex:PMOSSOT23: MOS FET
T2-T6 = 000_cpv:PMOSSOT23: MOS FET
TP1-TP12 = 140182-1-v2.0-j2b-synth:TP: Test pad
U$1 = SparkFun-Aesthetics:OSHW-LOGO: Open Source Hardware Logo This logo indicates the piece of hardware it is found on incorporates a OSHW license and/or adheres to the definition of open source hardware found here: http://freedomdefined.org/OSHW
U$2 = 140182-1-v2.0-j2b-synth:CREATIVE_COMMONS: Creative Commons License summary
X1 = 000_cpv:CRYSTAL: CRYSTAL